# EAGLE schematic board (EAGLE 6.6.0)
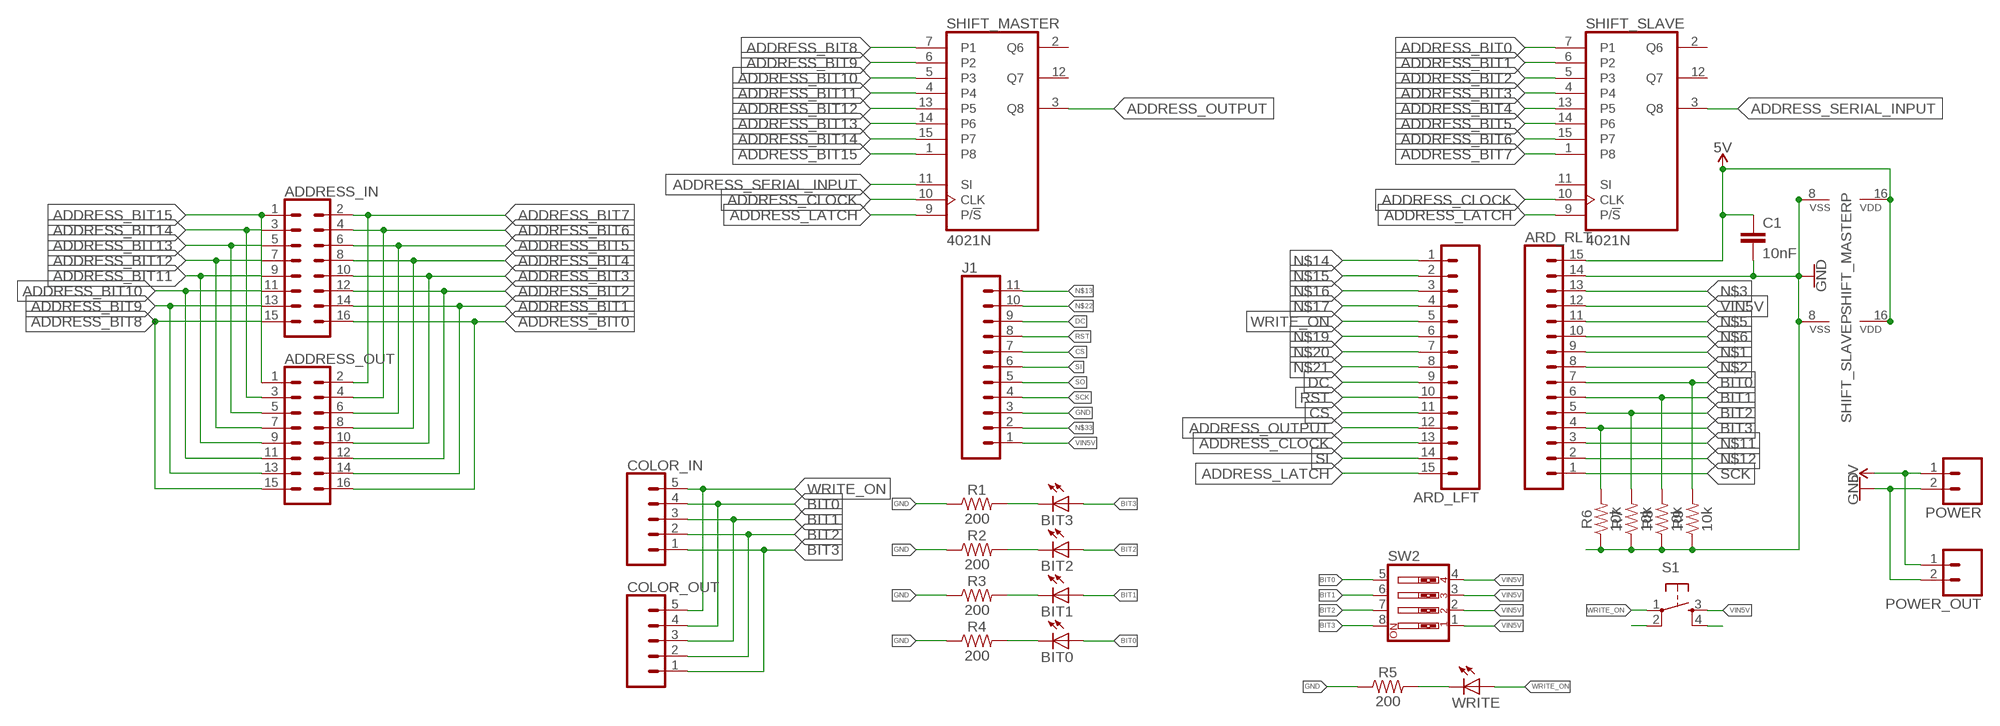
[diagram p0: schematic, sheet 1]

## Parts
ADDRESS_IN  CONN_08X2  [2X8]
ADDRESS_OUT  CONN_08X2  [2X8]
ARD_LFT  CONN_15  [1X15]
ARD_RLT  CONN_15  [1X15]
BIT0  LED5MM  [LED5MM]
BIT1  LED5MM  [LED5MM]
BIT2  LED5MM  [LED5MM]
BIT3  LED5MM  [LED5MM]
C1  10nF  10NF-PTH-10MM-10000V-1-%  [CAP-PTH-10MM]
COLOR_IN  CONN_05  [1X05]
COLOR_OUT  CONN_05  [1X05]
J1  CONN_11  [1X11]
POWER  CONN_02  [1X02]
POWER_OUT  CONN_02  [1X02]
R1  200  RESISTORAXIAL-0.3  [AXIAL-0.3]
R2  200  RESISTORAXIAL-0.3  [AXIAL-0.3]
R3  200  RESISTORAXIAL-0.3  [AXIAL-0.3]
R4  200  RESISTORAXIAL-0.3  [AXIAL-0.3]
R5  200  RESISTORAXIAL-0.3  [AXIAL-0.3]
R6  10k  10KOHM-HORIZ-1/4W-5%  [AXIAL-0.3]
R7  10k  10KOHM-HORIZ-1/4W-5%  [AXIAL-0.3]
R8  10k  10KOHM-HORIZ-1/4W-5%  [AXIAL-0.3]
R9  10k  10KOHM-HORIZ-1/4W-5%  [AXIAL-0.3]
S1  TAC_SWITCHPTH  [TACTILE-PTH]
SHIFT_MASTER  4021N  [DIL16]
SHIFT_SLAVE  4021N  [DIL16]
SW2  SW_DIP-4  [EDG-04]
WRITE  LED5MM  [LED5MM]

## Nets
5V: ARD_RLT.15 C1.1 POWER.1 POWER_OUT.1 SHIFT_MASTER.16(VDD) SHIFT_SLAVE.16(VDD)
ADDRESS_BIT0: ADDRESS_IN.16 ADDRESS_OUT.16 SHIFT_SLAVE.7(P1)
ADDRESS_BIT1: ADDRESS_IN.14 ADDRESS_OUT.14 SHIFT_SLAVE.6(P2)
ADDRESS_BIT2: ADDRESS_IN.12 ADDRESS_OUT.12 SHIFT_SLAVE.5(P3)
ADDRESS_BIT3: ADDRESS_IN.10 ADDRESS_OUT.10 SHIFT_SLAVE.4
ADDRESS_BIT4: ADDRESS_IN.8 ADDRESS_OUT.8 SHIFT_SLAVE.13(P5)
ADDRESS_BIT5: ADDRESS_IN.6 ADDRESS_OUT.6 SHIFT_SLAVE.14(P6)
ADDRESS_BIT6: ADDRESS_IN.4 ADDRESS_OUT.4 SHIFT_SLAVE.15(P7)
ADDRESS_BIT7: ADDRESS_IN.2 ADDRESS_OUT.2 SHIFT_SLAVE.1(P8)
ADDRESS_BIT8: ADDRESS_IN.15 ADDRESS_OUT.15 SHIFT_MASTER.7(P1)
ADDRESS_BIT9: ADDRESS_IN.13 ADDRESS_OUT.13 SHIFT_MASTER.6(P2)
ADDRESS_BIT10: ADDRESS_IN.11 ADDRESS_OUT.11 SHIFT_MASTER.5(P3)
ADDRESS_BIT11: ADDRESS_IN.9 ADDRESS_OUT.9 SHIFT_MASTER.4
ADDRESS_BIT12: ADDRESS_IN.7 ADDRESS_OUT.7 SHIFT_MASTER.13(P5)
ADDRESS_BIT13: ADDRESS_IN.5 ADDRESS_OUT.5 SHIFT_MASTER.14(P6)
ADDRESS_BIT14: ADDRESS_IN.3 ADDRESS_OUT.3 SHIFT_MASTER.15(P7)
ADDRESS_BIT15: ADDRESS_IN.1 ADDRESS_OUT.1 SHIFT_MASTER.1(P8)
ADDRESS_CLOCK: ARD_LFT.13 SHIFT_MASTER.10(CLK) SHIFT_SLAVE.10(CLK)
ADDRESS_LATCH: ARD_LFT.15 SHIFT_MASTER.9(P/!S) SHIFT_SLAVE.9(P/!S)
ADDRESS_OUTPUT: ARD_LFT.12 SHIFT_MASTER.3(Q8)
ADDRESS_SERIAL_INPUT: SHIFT_MASTER.11(SI) SHIFT_SLAVE.3(Q8)
BIT0: ARD_RLT.7 BIT0.A COLOR_IN.4 COLOR_OUT.4 R9.P$2 SW2.5
BIT1: ARD_RLT.6 BIT1.A COLOR_IN.3 COLOR_OUT.3 R8.P$2 SW2.6
BIT2: ARD_RLT.5 BIT2.A COLOR_IN.2 COLOR_OUT.2 R7.P$2 SW2.7
BIT3: ARD_RLT.4 BIT3.A COLOR_IN.1 COLOR_OUT.1 R6.P$2 SW2.8
CS: ARD_LFT.11 J1.7
DC: ARD_LFT.9 J1.9
GND: ARD_RLT.14 C1.2 J1.3 POWER.2 POWER_OUT.2 R1.P$1 R2.P$1 R3.P$1 R4.P$1 R5.P$1 R6.P$1 R7.P$1 R8.P$1 R9.P$1 SHIFT_MASTER.8(VSS) SHIFT_SLAVE.8(VSS)
N$1: ARD_RLT.9
N$2: ARD_RLT.8
N$3: ARD_RLT.13
N$4: R5.P$2 WRITE.K(C)
N$5: ARD_RLT.11
N$6: ARD_RLT.10
N$9: S1.4
N$11: ARD_RLT.3
N$12: ARD_RLT.2
N$13: J1.11
N$14: ARD_LFT.1
N$15: ARD_LFT.2
N$16: ARD_LFT.3
N$17: ARD_LFT.4
N$18: S1.2
N$19: ARD_LFT.6
N$20: ARD_LFT.7
N$21: ARD_LFT.8
N$22: J1.10
N$29: BIT0.K(C) R4.P$2
N$30: BIT1.K(C) R3.P$2
N$31: BIT2.K(C) R2.P$2
N$32: BIT3.K(C) R1.P$2
N$33: J1.2
RST: ARD_LFT.10 J1.8
SCK: ARD_RLT.1 J1.4
SI: ARD_LFT.14 J1.6
SO: J1.5
VIN5V: ARD_RLT.12 J1.1 S1.3 SW2.1 SW2.2 SW2.3 SW2.4
WRITE_ON: ARD_LFT.5 COLOR_IN.5 COLOR_OUT.5 S1.1 WRITE.A
Unconnected: SHIFT_MASTER.2(Q6) SHIFT_MASTER.12(Q7) SHIFT_SLAVE.2(Q6) SHIFT_SLAVE.11(SI) SHIFT_SLAVE.12(Q7)

## Library data of the parts
ADDRESS_IN ADDRESS_OUT = SparkFun-Connectors:CONN_08X2: Multi connection point. Often used as Generic Header-pin footprint for 0.1 inch spaced/style header connections You can populate with any combo of single row headers, but if you'd like an exact match, check this: Header - 2x8 (Male, 0.1") <https://www.sparkfun.com/products/13156> (PRT-13156) On any of the 0.1 inch spaced packages, you can populate with these: Break Away Headers - Straight <https://www.sparkfun.com/products/116> (PRT-00116) Break Away Male Headers - Right Angle <https://www.sparkfun.com/products/553> (PRT-00553) Female Headers <https://www.sparkfun.com/products/115> (PRT-00115) Break Away Headers - Machine Pin <https://www.sparkfun.com/products/117> (PRT-00117) Break Away Female Headers - Swiss Machine Pin <https://www.sparkfun.com/products/743> (PRT-00743)
ARD_LFT ARD_RLT = SparkFun-Connectors:CONN_15: Multi connection point. Often used as Generic Header-pin footprint for 0.1 inch spaced/style header connections On any of the 0.1 inch spaced packages, you can populate with these: Break Away Headers - Straight <https://www.sparkfun.com/products/116> (PRT-00116) Break Away Male Headers - Right Angle <https://www.sparkfun.com/products/553> (PRT-00553) Female Headers <https://www.sparkfun.com/products/115> (PRT-00115) Break Away Headers - Machine Pin <https://www.sparkfun.com/products/117> (PRT-00117) Break Away Female Headers - Swiss Machine Pin <https://www.sparkfun.com/products/743> (PRT-00743) For SCREWTERMINALS and SPRING TERMINALS visit here: Screw Terimnals on SparkFun.com <https://www.sparkfun.com/search/results?term=Screw+Terminals> (5mm/3.5mm/2.54mm spacing) This device is also useful as a general connection point to wire up your design to another part of your project. Our various solder wires solder well into these plated through hole pads. Hook-Up Wire - Assortment (Stranded, 22 AWG) <https://www.sparkfun.com/products/11375> (PRT-11375) Hook-Up Wire - Assortment (Solid Core, 22 AWG) <https://www.sparkfun.com/products/11367> (PRT-11367) View the entire wire category on our website here <https://www.sparkfun.com/categories/141> Special notes: Molex polarized connector foot print use with SKU : PRT-08231 with associated crimp pins and housings. 1MM SMD Version SKU: PRT-10208 NOTES ON THE VARIANTS LOCK and LOCK_LONGPADS... This footprint was designed to help hold the alignment of a through-hole component (i.e. 6-pin header) while soldering it into place. You may notice that each hole has been shifted either up or down by 0.005 of an inch from it's more standard position (which is a perfectly straight line). This slight alteration caused the pins (the squares in the middle) to touch the edges of the holes. Because they are alternating, it causes a "brace" to hold the component in place. 0.005 has proven to be the perfect amount of "off-center" position when using our standard breakaway headers. Although looks a little odd when you look at the bare footprint, once you have a header in there, the alteration is very hard to notice. Also,if you push a header all the way into place, it is covered up entirely on the bottom side.
BIT0 BIT1-BIT3 WRITE = adafruit:LED: LED OSRAM: - CHIPLED LG R971, LG N971, LY N971, LG Q971, LY Q971, LO R971, LY R971 LH N974, LH R974 LS Q976, LO Q976, LY Q976 LO Q996 - Hyper CHIPLED LW Q18S LB Q993, LB Q99A, LB R99A - SideLED LS A670, LO A670, LY A670, LG A670, LP A670 LB A673, LV A673, LT A673, LW A673 LH A674 LY A675 LS A676, LA A676, LO A676, LY A676, LW A676 LS A679, LY A679, LG A679 - Hyper Micro SIDELED® LS Y876, LA Y876, LO Y876, LY Y876 LT Y87S - SmartLED LW L88C, LW L88S LB L89C, LB L89S, LG L890 LS L89K, LO L89K, LY L89K LS L896, LA L896, LO L896, LY L896 - TOPLED LS T670, LO T670, LY T670, LG T670, LP T670 LSG T670, LSP T670, LSY T670, LOP T670, LYG T670 LG T671, LOG T671, LSG T671 LB T673, LV T673, LT T673, LW T673 LH T674 LS T676, LA T676, LO T676, LY T676, LB T676, LH T676, LSB T676, LW T676 LB T67C, LV T67C, LT T67C, LS T67K, LO T67K, LY T67K, LW E67C LS E67B, LA E67B, LO E67B, LY E67B, LB E67C, LV E67C, LT E67C LW T67C LS T679, LY T679, LG T679 LS T770, LO T770, LY T770, LG T770, LP T770 LB T773, LV T773, LT T773, LW T773 LH T774 LS E675, LA E675, LY E675, LS T675 LS T776, LA T776, LO T776, LY T776, LB T776 LHGB T686 LT T68C, LB T68C - Hyper Mini TOPLED® LB M676 - Mini TOPLED Santana® LG M470 LS M47K, LO M47K, LY M47K Source: http://www.osram.convergy.de/
C1 = SparkFun-Capacitors:10NF: 0.01uF/10nF/10,000pF ceramic capacitors A capacitor is a passive two-terminal electrical component used to store electrical energy temporarily in an electric field. CAP-09321; PROD_ID: CAP-09321
COLOR_IN COLOR_OUT = SparkFun-Connectors:CONN_05: Multi connection point. Often used as Generic Header-pin footprint for 0.1 inch spaced/style header connections On any of the 0.1 inch spaced packages, you can populate with these: Break Away Headers - Straight <https://www.sparkfun.com/products/116> (PRT-00116) Break Away Male Headers - Right Angle <https://www.sparkfun.com/products/553> (PRT-00553) Female Headers <https://www.sparkfun.com/products/115> (PRT-00115) Break Away Headers - Machine Pin <https://www.sparkfun.com/products/117> (PRT-00117) Break Away Female Headers - Swiss Machine Pin <https://www.sparkfun.com/products/743> (PRT-00743) For SCREWTERMINALS and SPRING TERMINALS visit here: Screw Terimnals on SparkFun.com <https://www.sparkfun.com/search/results?term=Screw+Terminals> (5mm/3.5mm/2.54mm spacing) This device is also useful as a general connection point to wire up your design to another part of your project. Our various solder wires solder well into these plated through hole pads. Hook-Up Wire - Assortment (Stranded, 22 AWG) <https://www.sparkfun.com/products/11375> (PRT-11375) Hook-Up Wire - Assortment (Solid Core, 22 AWG) <https://www.sparkfun.com/products/11367> (PRT-11367) View the entire wire category on our website here <https://www.sparkfun.com/categories/141> Special notes: Molex polarized connector foot print use with SKU : PRT-08231 with associated crimp pins and housings. 1MM SMD Version SKU: PRT-10208
J1 = SparkFun-Connectors:CONN_11: Multi connection point. Often used as Generic Header-pin footprint for 0.1 inch spaced/style header connections On any of the 0.1 inch spaced packages, you can populate with these: Break Away Headers - Straight <https://www.sparkfun.com/products/116> (PRT-00116) Break Away Male Headers - Right Angle <https://www.sparkfun.com/products/553> (PRT-00553) Female Headers <https://www.sparkfun.com/products/115> (PRT-00115) Break Away Headers - Machine Pin <https://www.sparkfun.com/products/117> (PRT-00117) Break Away Female Headers - Swiss Machine Pin <https://www.sparkfun.com/products/743> (PRT-00743) For SCREWTERMINALS and SPRING TERMINALS visit here: Screw Terimnals on SparkFun.com <https://www.sparkfun.com/search/results?term=Screw+Terminals> (5mm/3.5mm/2.54mm spacing) This device is also useful as a general connection point to wire up your design to another part of your project. Our various solder wires solder well into these plated through hole pads. Hook-Up Wire - Assortment (Stranded, 22 AWG) <https://www.sparkfun.com/products/11375> (PRT-11375) Hook-Up Wire - Assortment (Solid Core, 22 AWG) <https://www.sparkfun.com/products/11367> (PRT-11367) View the entire wire category on our website here <https://www.sparkfun.com/categories/141>
POWER POWER_OUT = SparkFun-Connectors:CONN_02: Multi connection point. Often used as Generic Header-pin footprint for 0.1 inch spaced/style header connections On any of the 0.1 inch spaced packages, you can populate with these: Break Away Headers - Straight <https://www.sparkfun.com/products/116> (PRT-00116) Break Away Male Headers - Right Angle <https://www.sparkfun.com/products/553> (PRT-00553) Female Headers <https://www.sparkfun.com/products/115> (PRT-00115) Break Away Headers - Machine Pin <https://www.sparkfun.com/products/117> (PRT-00117) Break Away Female Headers - Swiss Machine Pin <https://www.sparkfun.com/products/743> (PRT-00743) For SCREWTERMINALS and SPRING TERMINALS visit here: Screw Terimnals on SparkFun.com <https://www.sparkfun.com/search/results?term=Screw+Terminals> (5mm/3.5mm/2.54mm spacing) This device is also useful as a general connection point to wire up your design to another part of your project. Our various solder wires solder well into these plated through hole pads. Hook-Up Wire - Assortment (Stranded, 22 AWG) <https://www.sparkfun.com/products/11375> (PRT-11375) Hook-Up Wire - Assortment (Solid Core, 22 AWG) <https://www.sparkfun.com/products/11367> (PRT-11367) View the entire wire category on our website here <https://www.sparkfun.com/categories/141> Special notes: Molex polarized connector foot print use with: PRT-08233 with associated crimp pins and housings. 2.54_SCREWTERM for use with PRT-10571. 3.5mm Screw Terminal footprints for PRT-08084 5mm Screw Terminal footprints for use with PRT-08432
R1-R5 = SparkFun-Resistors:RESISTOR: Generic Resistor Package
R6-R9 = SparkFun-Resistors:10KOHM: 10kΩ resistor A resistor is a passive two-terminal electrical component that implements electrical resistance as a circuit element. Resistors act to reduce current flow, and, at the same time, act to lower voltage levels within circuits. - Wikipedia; PROD_ID: RES-09435
S1 = SparkFun-Retired:TAC_SWITCH: Momentary Switch Button commonly used for reset or general input. Spark Fun Electronics SKU : COM-00097 SMT- SWCH-08247
SHIFT_MASTER SHIFT_SLAVE = 40xx:4021: 8-bit static SHIFT REGISTER
SW2 = special:SW_DIP-4: DIP SWITCH